# Altium schematic sheet EVB-A32M1-F_Schematic.SchDoc
size A3; SheetNumber: 1; SheetTotal: 1; Size: A4
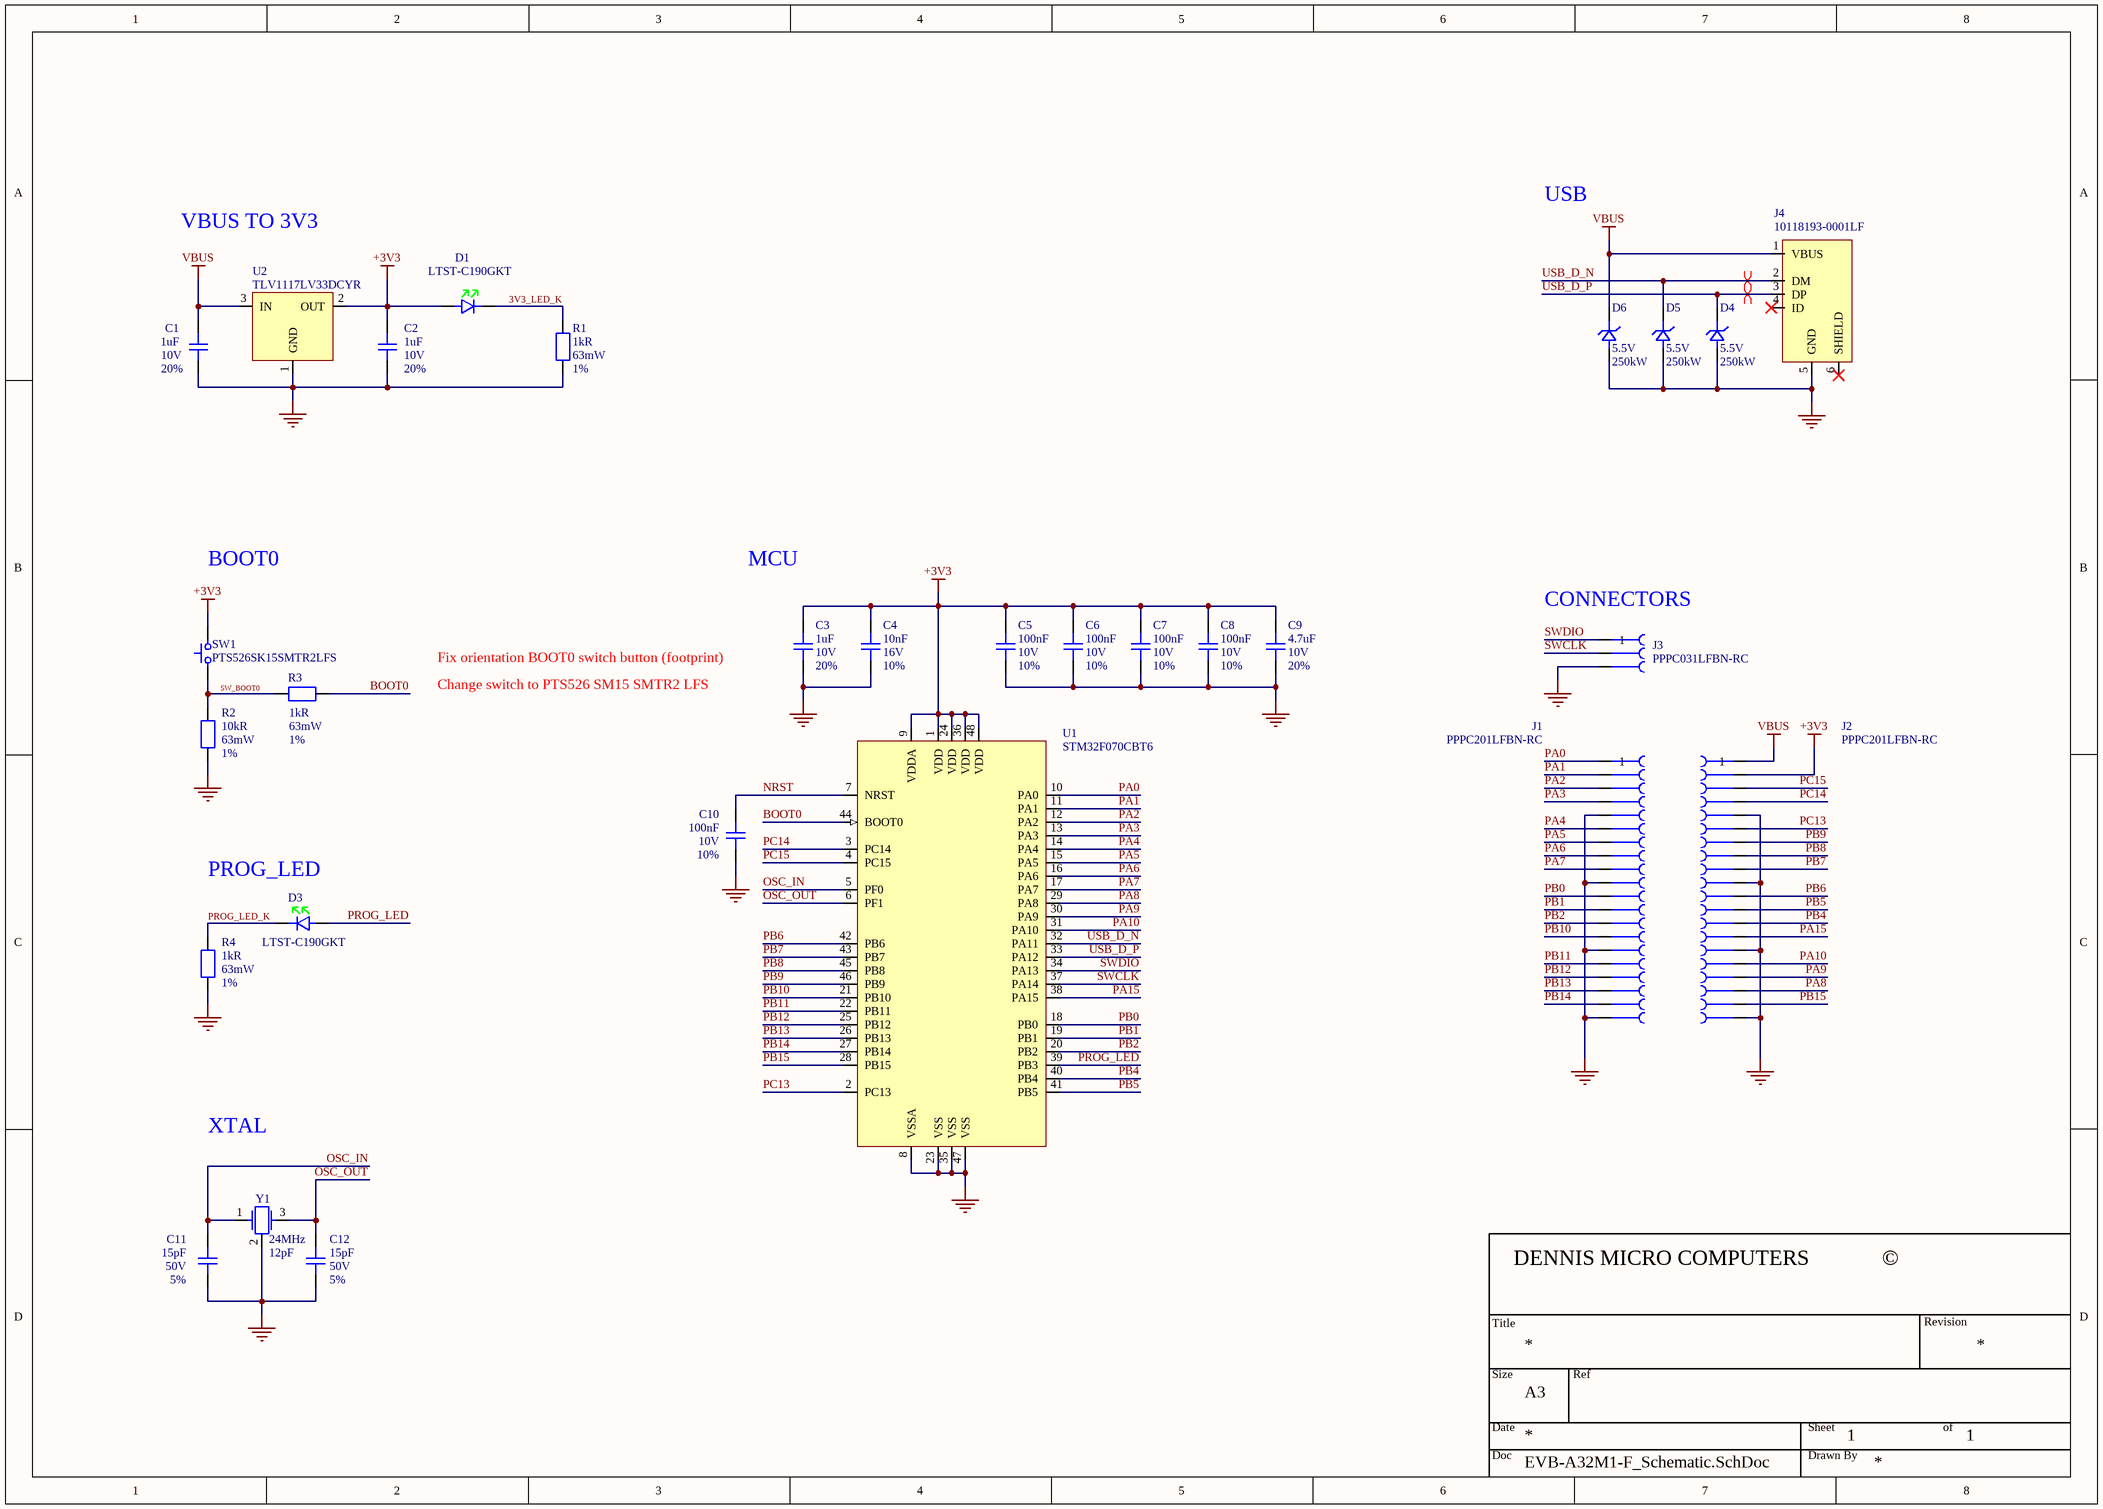
[diagram p0: EVB-A32M1-F_Schematic.SchDoc]

## Parts
C1  value 1uF  Voltage Rating (DC): 10V  Tolerance: 20%  [C_Yageo_CC_0402_A]  (hidden comment: CC0402MRX5R6BB105)
C2  value 1uF  Voltage Rating (DC): 10V  Tolerance: 20%  [C_Yageo_CC_0402_A]  (hidden comment: CC0402MRX5R6BB105)
C3  value 1uF  Voltage Rating (DC): 10V  Tolerance: 20%  [C_Yageo_CC_0402_A]  (hidden comment: CC0402MRX5R6BB105)
C4  value 10nF  Tolerance: 10%  Voltage Rating: 16V  [C_Yageo_CC_0402_A]  (hidden comment: CC0402KRX7R7BB103)
C5  value 100nF  Voltage Rating (DC): 10V  Tolerance: 10%  [C_Samsung_CL_0402_A]  (hidden comment: CL05B104KP5NNNC)
C6  value 100nF  Voltage Rating (DC): 10V  Tolerance: 10%  [C_Samsung_CL_0402_A]  (hidden comment: CL05B104KP5NNNC)
C7  value 100nF  Voltage Rating: 10V  Tolerance: 10%  [C_Samsung_CL_0402_A]  (hidden comment: CL05B104KP5NNNC)
C8  value 100nF  Voltage Rating: 10V  Tolerance: 10%  [C_Samsung_CL_0402_A]  (hidden comment: CL05B104KP5NNNC)
C9  value 4.7uF  Tolerance: 20%  Voltage Rating: 10V  [C_Samsung_CL_0402_A]  (hidden comment: CL05A475MP5NRNC)
C10  value 100nF  Voltage Rating (DC): 10V  Tolerance: 10%  [C_Samsung_CL_0402_A]  (hidden comment: CL05B104KP5NNNC)
C11  value 15pF  Tolerance: 5%  Voltage Rating: 50V  [C_Yageo_CC_0402_A]  (hidden comment: CC0402JRNPO9BN150)
C12  value 15pF  Tolerance: 5%  Voltage Rating: 50V  [C_Yageo_CC_0402_A]  (hidden comment: CC0402JRNPO9BN150)
D1  LTST-C190GKT  [D_LED_Lite-On_Green_0603_A]
D3  LTST-C190GKT  [D_LED_Lite-On_Green_0603_A]
D4  Reverse Standoff Voltage: 5.5V  Peak Pulse Power: 250kW  [D_TVS_Uni_Diodes_SOD-923_B]  (hidden comment: D5V0F1U2S9-7)
D5  Reverse Standoff Voltage: 5.5V  Peak Pulse Power: 250kW  [D_TVS_Uni_Diodes_SOD-923_B]  (hidden comment: D5V0F1U2S9-7)
D6  Reverse Standoff Voltage: 5.5V  Peak Pulse Power: 250kW  [D_TVS_Uni_Diodes_SOD-923_B]  (hidden comment: D5V0F1U2S9-7)
J1  PPPC201LFBN-RC  [J_Cast_TH20_Top_2.54mm]
J2  PPPC201LFBN-RC  [J_Cast_TH20_Bottom_2.54mm]
J3  PPPC031LFBN-RC  [J_Cast_TH3_Bottom_2.54mm]
J4  10118193-0001LF  [J_USB_Micro-B_Amphenol_10118193-0001LF]
R1  value 1kR  Max Power Dissipation: 63mW  Resistance Tolerance: 1%  [R_Yageo_RCL_0402_A]  (hidden comment: RC0402FR-071KL)
R2  value 10kR  Resistance Tolerance: 1%  Max Power Dissipation: 63mW  [R_Yageo_RCL_0402_A]  (hidden comment: RC0402FR-0710KL)
R3  value 1kR  Max Power Dissipation: 63mW  Resistance Tolerance: 1%  [R_Yageo_RCL_0402_A]  (hidden comment: RC0402FR-071KL)
R4  value 1kR  Max Power Dissipation: 63mW  Resistance Tolerance: 1%  [R_Yageo_RCL_0402_A]  (hidden comment: RC0402FR-071KL)
SW1  PTS526SK15SMTR2LFS  [SW_Tactitle_SPST_C&K_PTS526 SK15 SMTR2 LFS]
U1  STM32F070CBT6  [U_ST_LQFP48_B]
U2  TLV1117LV33DCYR  [U_TI_SOT-223_B]
Y1  Frequency: 24MHz  Load Capacitance: 12pF  [Y_Crystal_GND24_ECS_240-12-37B-CKY-TR]  (hidden comment: ECS-240-12-37B-CKY-TR)

## Nets
+3V3: C2.2 C3.2 C4.2 C5.2 C6.2 C7.2 C8.2 C9.2 D1.2 J2.2 SW1.2 U1.1(VDD) U1.9(VDDA) U1.24(VDD) U1.36(VDD) U1.48(VDD) U2.2(OUT)
GND: C1.1 C2.1 C3.1 C4.1 C5.1 C6.1 C7.1 C8.1 C9.1 C10.1 C11.1 C12.1 D4.2 D5.2 D6.2 J1.5 J1.10 J1.15 J1.20 J2.5 J2.10 J2.15 J2.20 J3.3 J4.5(GND) R1.1 R2.1 R4.1 U1.8(VSSA) U1.23(VSS) U1.35(VSS) U1.47(VSS) U2.1(GND) Y1.2
VBUS: C1.2 D6.1 J2.1 J4.1(VBUS) U2.3(IN)
3V3_LED_K: D1.1 R1.2
BOOT0: R3.1 U1.44(BOOT0)
NRST: C10.2 U1.7(NRST)
OSC_IN: C11.2 U1.5(PF0) Y1.1
OSC_OUT: C12.2 U1.6(PF1) Y1.3
PA0: J1.1 U1.10(PA0)
PA1: J1.2 U1.11(PA1)
PA2: J1.3 U1.12(PA2)
PA3: J1.4 U1.13(PA3)
PA4: J1.6 U1.14(PA4)
PA5: J1.7 U1.15(PA5)
PA6: J1.8 U1.16(PA6)
PA7: J1.9 U1.17(PA7)
PA8: J2.18 U1.29(PA8)
PA9: J2.17 U1.30(PA9)
PA10: J2.16 U1.31(PA10)
PA15: J2.14 U1.38(PA15)
PB0: J1.11 U1.18(PB0)
PB1: J1.12 U1.19(PB1)
PB2: J1.13 U1.20(PB2)
PB4: J2.13 U1.40(PB4)
PB5: J2.12 U1.41(PB5)
PB6: J2.11 U1.42(PB6)
PB7: J2.9 U1.43(PB7)
PB8: J2.8 U1.45(PB8)
PB9: J2.7 U1.46(PB9)
PB10: J1.14 U1.21(PB10)
PB11: J1.16 U1.22(PB11)
PB12: J1.17 U1.25(PB12)
PB13: J1.18 U1.26(PB13)
PB14: J1.19 U1.27(PB14)
PB15: J2.19 U1.28(PB15)
PC13: J2.6 U1.2(PC13)
PC14: J2.4 U1.3(PC14)
PC15: J2.3 U1.4(PC15)
PROG_LED: D3.2 U1.39(PB3)
PROG_LED_K: D3.1 R4.2
SW_BOOT0: R2.2 R3.2 SW1.1
SWCLK: J3.2 U1.37(PA14)
SWDIO: J3.1 U1.34(PA13)
USB_D_N: D5.1 J4.2(DM) U1.32(PA11)
USB_D_P: D4.1 J4.3(DP) U1.33(PA12)

Not connected (* = marked no-connect by the designer): J4 4(ID)* 6(SHIELD)*

## Layout directives
differential pair; differential pair class DIFF_USB: USB_D_N, USB_D_P

## Notes on the sheet
- VBUS TO 3V3
- USB
- BOOT0
- MCU
- (near J3) CONNECTORS
- (near C3) Fix orientation BOOT0 switch button (footprint)
- Change switch to PTS526 SM15 SMTR2 LFS
- (near D3) PROG_LED
- XTAL
- Title
- DENNIS MICRO COMPUTERS
- ©
- Revision
- Size
- A3
- Ref
- Date
- Doc
- Sheet
- Drawn By
- of

## Library data of the parts
C1-C3 = CMP-001-00016-11: Multilayer Ceramic Capacitor, 1 uF, 50 V, ± 10%, X5R, 0402 [1005 Metric]; Temperature Coefficient: 30ppm/°C; Material: Ceramic; Case Code (Metric): 1005; Case Code (Imperial): 0402; Case/Package: 0402; Width: 0.02inch; Pins: 2; LCSC Part Number: C113791; Dielectric: X5R; Termination: SMD/SMT; Mounting Technology: Surface Mount; Dissipation Factor: 10%; RoHS Compliant: Yes; Height: 0.5mm; Series: CC; Voltage Rating: 10V; Packaging: Tape and Reel; ComponentLink1URL: https://www.yageo.com/upload/media/product/app/datasheet/mlcc/upy-gphc_x5r_4v-to-50v.pdf; Thickness: 0.022inch; Min Operating Temperature: -55°C; Lead Free: Lead Free; Max Operating Temperature: 85°C; ComponentLink1Description: Datasheet; Halogen Free: Halogen Free; Length: 0.039inch
C4 = CMP-001-00029-1: Multilayer Ceramic Capacitor, 0.01 uF, 16 V, ± 10%, X7R, 0402 [1005 Metric]; Dissipation Factor: 3.5%; Temperature Coefficient: 30ppm/°C; Insulation Resistance: 10GR; Termination: SMD/SMT; Package Quantity: 1; ComponentLink1URL: https://www.yageo.com/upload/media/product/productsearch/datasheet/mlcc/UPY-GPHC_X7R_6.3V-to-250V_24.pdf; Series: CC; Dielectric: X7R; Min Operating Temperature: -55°C; Length: 1mm; Depth: 0.5mm; Case/Package: 0402; Lead Free: Lead Free; Mounting Technology: Surface Mount; Pins: 2; ComponentLink1Description: Datasheet; Reach SVHC Compliant: No; Voltage Rating (DC): 16V; Thickness: 0.022inch; Width: 0.02inch; Max Operating Temperature: 125°C; Voltage Rating (AC): 16V; Radiation Hardening: No; Case Code (Imperial): 0402; Halogen Free: Halogen Free; Height: 0.5mm; Case Code (Metric): 1005; Packaging: Tape and Reel; RoHS Compliant: Yes; Material: Ceramic
C5-C8 C10 = CMP-001-00023-3: Multilayer Ceramic Capacitor, 0.1 uF, 10 V, ± 10%, X7R, 0402 [1005 Metric]; RoHS Compliant: Yes; Max Operating Temperature: 125°C; Mounting Technology: Surface Mount; Material: Ceramic; Depth: 0.5mm; Thickness: 0.022inch; Packaging: Tape and Reel; Case Code (Imperial): 0402; Height: 0.5mm; Width: 0.02inch; Min Operating Temperature: -55°C; Length: 1mm; Package Quantity: 1; Dielectric: X7R; Radiation Hardening: No; Construction: Flat; Case/Package: 0402; Case Code (Metric): 1005; Series: CL
  C5 C6 C10: Voltage Rating: 10V
  C7 C8: Voltage Rating (DC): 10V
C9 = CMP-001-00024-3: Multilayer Ceramic Capacitor, 4.7 uF, 10 V, ± 20%, X5R, 0402 [1005 Metric]; Case Code (Metric): 1005; ComponentLink1Description: Datasheet; Max Operating Temperature: 85°C; Material: Ceramic; Case Code (Imperial): 0402; Lead Free: Lead Free; Height: 550um; RoHS Compliant: Yes; Mounting Technology: Surface Mount; Series: CL; Packaging: Cut Tape; Dielectric: X5R; Case/Package: 0402; ComponentLink1URL: https://mm.digikey.com/Volume0/opasdata/d220001/medias/docus/863/CL05A475MP5NRNC_Spec.pdf; Min Operating Temperature: -55°C
C11 C12 = CMP-001-00017-14: Multilayer Ceramic Capacitor, 15 pF, 10 V, ± 5%, X7R, 0402 [1005 Metric]; Temperature Coefficient: 30ppm/°C; Dielectric: C0G; Insulation Resistance: 100GR; RoHS Compliant: Yes; Radiation Hardening: No; Lead Free: Lead Free; Pins: 2; Case Code (Metric): 1005; Mounting Technology: Surface Mount; Termination: SMD/SMT; Voltage Rating (DC): 50V; Packaging: Tape and Reel; Material: Ceramic; Height: 0.5mm; Package Quantity: 1; Thickness: 0.022inch; ComponentLink1URL: https://www.yageo.com/upload/media/product/productsearch/datasheet/mlcc/UPY-GP_NP0_16V-to-50V_18.pdf; Dielectric Material: Ceramic; Voltage Rating (AC): 50V; Case/Package: 0402; Halogen Free: Halogen Free; Depth: 0.5mm; ComponentLink1Description: Datasheet; Length: 1mm; Case Code (Imperial): 0402; Width: 0.02inch; Min Operating Temperature: -55°C; Reach SVHC Compliant: No; Voltage: 50V; Series: CC; Max Operating Temperature: 125°C
D1 D3 = CMP-007-00001-3: LED Uni-Color Green 565nm 2-Pin Chip LED T/R; Dominant Wavelength: 569nm; Forward Current: 30mA; Reverse Voltage: 5V; Lens Transparency: Clear; Power Dissipation: 100mW; Number of Elements: 1; Viewing Angle: 130°; Test Current: 10mA; Forward Voltage: 2.1V; Lens Color: Colorless; Voltage: 2V; Lens Size: 0.8mm; Lens Style: Flat,Diffused,Colorless,Rectangular,Clear; Luminous Intensity: 6mcd; ComponentLink1URL: https://mm.digikey.com/Volume0/opasdata/d220001/medias/docus/858/LTST-C190GKT.pdf; Width: 0.8mm; Lead Free: Lead Free; Height: 0.9mm; Max Operating Temperature: 85°C; Pins: 2; Wavelength: 565nm; Radiation Hardening: No; Series: -; Mounting Technology: Surface Mount; Min Operating Temperature: -55°C; Depth: 0.8mm; Power Rating: 100mW; Length: 1.6mm; ComponentLink1Description: Datasheet; Packaging: Tape and Reel; Case Code (Imperial): 0603; Case/Package: 0603; Illumination Color: Green; Color: Green; Number of LEDs: 1; Case Code (Metric): 1608; Package Quantity: 1; RoHS Compliant: Yes
D4-D6 = CMP-004-00007-2: Diode TVS Dual Uni-Dir 5.5V 250000W 2-Pin SOD-923 T/R; Max Reverse Leakage Current: 100nA; Number of Unidirectional Channels: 1; ESD Protection: Yes; Diode Type: ZENER; Max Surge Current: 1.5A; Min Breakdown Voltage: 6V; Polarity: Unidirectional; Value: 5E-13F; Max Power Dissipation: 250mW; Clamping Voltage: 10V; Contact Plating: Tin,Matte; Termination: SMD/SMT; ComponentLink1URL: https://www.diodes.com/assets/Datasheets/D5V0F1U2S9.pdf; Min Operating Temperature: -65°C; RoHS Compliant: Yes; Peak Pulse Current: 1.5A; Series: -; ComponentLink1Description: Datasheet; Case/Package: SOD-923-2; Power Line Protection: Yes; Max Operating Temperature: 150°C; Mounting Technology: Surface Mount; Package Quantity: 10000; Packaging: Tape and Reel; Direction: Unidirectional; Breakdown Voltage: 6V; Working Voltage: 5.5V
J1 J2 = CMP-002-00009-9: 20 Position Total Single Row 2.54 mm Pitch Straight Female Header; pin to pad: 1>1+1T+1B 2>2+2T+2B 3>3+3T+3B 4>4+4T+4B 5>5+5T+5B 6>6+6T+6B 7>7+7T+7B 8>8+8T+8B 9>9+9T+9B 10>10+10T+10B 11>11+11T+11B 12>12+12T+12B 13>13+13T+13B 14>14+14T+14B 15>15+15T+15B 16>16+16T+16B 17>17+17T+17B 18>18+18T+18B 19>19+19T+19B 20>20+20T+20B; Pitch: 2.54mm; Number of Positions: 20; Voltage Rating: 250V; Housing Material: Plastic; Fastening Type: Pull; Length: 51.3mm; ComponentLink1Description: Datasheet; Contact Material: Bronze; Contact Type: Female Socket; Height: 8.5mm; Mounting Technology: Through Hole; Contact Finish - Mating: GOLD; Flammability Rating: UL94 V-0; Insulation Material: Polyester; ComponentLink1URL: https://mm.digikey.com/Volume0/opasdata/d220001/medias/docus/937/Female_Headers.100_DS.pdf; Insulation Color: Black; Number of Rows: 1; Min Operating Temperature: -40°C; Connector Type: Header; Width: 2.5mm; Contact Shape: Square; Series: -; Lead Free: Lead Free; Termination: Solder; Packaging: Tray; Max Operating Temperature: 105°C; RoHS Compliant: Yes
J3 = CMP-002-00004-17: 3 Position Total Single Row 2.54 mm Pitch Straight Female Header; pin to pad: 1>1+1T+1B 2>2+2T+2B 3>3+3T+3B; Number of Positions: 3; Voltage Rating: 250V; Pitch: 2.54mm; ComponentLink1Description: Datasheet; Contact Finish - Mating: GOLD; Height: 8.5mm; Contact Type: Female Socket; Termination: Solder; Contact Shape: Square; Max Operating Temperature: 105°C; Lead Free: Lead Free; Number of Rows: 1; Min Operating Temperature: -40°C; Flammability Rating: UL94 V-0; Fastening Type: Pull; Contact Material: Bronze; Width: 2.5mm; Packaging: Tray; RoHS Compliant: Yes; ComponentLink1URL: https://mm.digikey.com/Volume0/opasdata/d220001/medias/docus/937/Female_Headers.100_DS.pdf; Housing Material: Plastic; Insulation Color: Black; Connector Type: Header; Series: -; Length: 8.12mm; Mounting Technology: Through Hole; Insulation Material: Polyester
J4 = CMP-002-00002-12: Usb Connector, 5 Contact(S), Female, Right Angle, Surface Mount Terminal, Locking, Receptacle; Max Voltage Rating (AC): 100V; USB Standard: USB 2.0; Connector Type: USB,Receptacle; Number of Contacts: 5; Number of Ports: 1; Insulation Resistance: 1GR; Pitch: 650um; Current Rating: 1.8A; Flammability Rating: UL94 V-0; Termination: Solder; Height: 3mm; Pins: 11; Min Operating Temperature: -55°C; Contact Plating: Gold; Depth: 5.67mm; ComponentLink2Description: Datasheet; Voltage Rating: 100V; Contact Material: Nickel,Gold; Packaging: Tape and Reel; Orientation: Right Angle; Series: -; Mounting Technology: Surface Mount,Horizontal; Housing Material: Polymer; Color: Black; ComponentLink1URL: https://cdn.amphenol-cs.com/media/wysiwyg/files/drawing/10118193.pdf; ComponentLink1Description: Drawing; Gender: Female; Package Quantity: 1200; Radiation Hardening: No; Max Operating Temperature: 85°C; Length: 7.86mm; Features: Shielded; ComponentLink2URL: https://cdn.amphenol-cs.com/media/wysiwyg/files/documentation/datasheet/inputoutput/io_usb_micro.pdf
R1 R3 R4 = CMP-009-00002-11: SMD Chip Resistor, 1 kOhm, ± 1%, 62.5 mW, 0402 [1005 Metric], Thick Film, General Purpose; Temperature Coefficient: 100ppm/°C; Voltage Rating (AC): 50V; Power Rating: 62.5mW; Lead Free: Lead Free; Min Operating Temperature: -55°C; Depth: 0.5mm; Pins: 2; Packaging: Tape and Reel; Height: 0.32mm; Width: 0.5mm; Series: RC; Case Code (Metric): 1005; Resistor Type: Thick Film; Reach SVHC Compliant: No; Military Standard: Not; Case Code (Imperial): 0402; ComponentLink1Description: Datasheet; Features: Moisture Resistant; Voltage Rating: 50V; Case/Package: 0402; Termination: SMD/SMT; Number of Terminations: 2; RoHS Compliant: Yes; Voltage Rating (DC): 50V; Construction: Rectangular; Technology: THICK FILM; Tolerance: 1%; Max Operating Temperature: 155°C; Length: 1mm; ComponentLink1URL: https://www.yageo.com/upload/media/product/products/datasheet/rchip/PYu-RC_Group_51_RoHS_L_12.pdf
R2 = CMP-009-00003-11: SMD Chip Resistor, 10 kOhm, ± 1%, 62.5 mW, 0402 [1005 Metric], Thick Film, General Purpose; Voltage Rating (DC): 50V; Temperature Coefficient: 100ppm/°C; Power Rating: 62.5mW; Pins: 2; Lead Pitch: 0.2mm; Case Code (Imperial): 0402; Voltage Rating: 50V; Min Operating Temperature: -55°C; Features: Moisture Resistant; Length: 1mm; Series: RC; Width: 0.5mm; Resistor Type: Thick Film; Case Code (Metric): 1005; ComponentLink1URL: https://www.yageo.com/upload/media/product/products/datasheet/rchip/PYu-RC_Group_51_RoHS_L_12.pdf; Tolerance: 1%; Lead Free: Lead Free; Case/Package: 0402; Packaging: Tape and Reel; Reach SVHC Compliant: Unknown; RoHS Compliant: Yes; Number of Terminations: 2; Military Standard: Not; Termination: SMD/SMT; Max Operating Temperature: 155°C; Construction: Rectangular; ComponentLink1Description: Datasheet; Depth: 0.5mm
SW1 = CMP-011-00002-2: Switch Tactile N.O. SPST Round Button Gull Wing 0.05A 12VDC 200000Cycles 2.45N SMD T/R; pin to pad: 1>1+2 2>3+4; Number of Positions: 2; Operating Force: 260gf; Actuator Type: Standard; Illumination Type: Non-Illuminated; Switch Function: Off-Mom; Switch Travel: 0.25mm; Ratings: IP40; Contact Current Rating: 50mA; Contact Resistance: 100mR; Voltage Rating (DC): 12V; Termination: Gull Wing; Mechanical Life: 200000Cycles; ComponentLink1Description: Datasheet; Min Operating Temperature: -20°C; Mounting Technology: Surface Mount; ComponentLink1URL: https://www.ckswitches.com/media/2780/pts526.pdf; Series: PTS526; Throw Configuration: SPST; Max Operating Temperature: 70°C; Height: 1.65mm
U1 = CMP-020-00002-1: IC MCU 32BIT 128KB FLASH 48LQFP; Operating Supply Voltage: 3.3V; Peripherals: POR,PWM,WDT,DMA; Number of I/Os: 37; Data Bus Width: 32b; Min Supply Voltage: 2.4V; Number of Timers/Counters: 8; Interface: I2C,SPI,USB,UART,USART; Max Supply Voltage: 3.6V; Core Architecture: ARM; Watchdog Timer: Yes; Max Power Dissipation: 364mW; Clock Frequency: 48MHz; RAM Size: 16KB; Number of ADC Channels: 1; Oscillator Type: Internal; Min Operating Temperature: -40°C; Package Quantity: 250; Weight: 0.006409oz; Series: STM32 F0; Memory Format: FLASH; Packaging: Tray; Pins: 48; Number of Programmable I/O: 37; RoHS Compliant: Yes; Case/Package: LQFP; Max Operating Temperature: 85°C; Lead Free: Lead Free; Memory Size: 128KB
U2 = CMP-019-00002-2: LDO Regulator Pos 3.3V 1A 4-Pin(3+Tab) SOT-223 T/R; pin to pad: 2>2+4; Output Type: Fixed; Power Supply Rejection Ratio (PSRR): 75dB; Polarity: Positive; Dropout Voltage: 570mV; Quiescent Current: 50uA; Max Supply Voltage: 5.5V; Accuracy: 2%; Number of Regulators: 1; Min Input Voltage: 2V; ComponentLink1URL: https://www.ti.com/lit/ds/symlink/tlv1117lv.pdf?HQS=dis-dk-null-digikeymode-dsf-pf-null-wwe&ts=1720283554424&ref_url=https%253A%252F%252Fwww.ti.com%252Fgeneral%252Fdocs%252Fsuppproductinfo.tsp%253FdistId%253D10%2526gotoUrl%253Dhttps%253A%252F%252Fwww.ti.com%252Flit%252Fgpn%252Ftlv1117lv; Output Current: 1A; Min Output Voltage: 3.3V; Max Output Voltage: 3.3V; Max Operating Temperature: 125°C; Pins: 4; RoHS Compliant: Yes; Min Operating Temperature: -40°C; Case/Package: SOT-223-4; Packaging: Cut Tape; ComponentLink1Description: Datasheet; Output Configuration: Positive; Series: -; Package Quantity: 2500; Lead Free: Lead Free; Max Output current: 1A; Weight: 0.009171oz; Operating Supply Current: 50uA
Y1 = CMP-003-00000-11: Crystal 24MHz ±10ppm (Tol) ±10ppm (Stability) 12pF FUND 50Ohm 4-Pin Mini-CSMD T/R; pin to pad: 2>2+4; Size: 0.079" L x 0.063" W (2.00mm x 1.60mm); Case/Package: 4-SMD, No Lead; ComponentLink1Description: Datasheet; ComponentLink1URL: https://ecsxtal.com/store/pdf/ECX-1637B.pdf